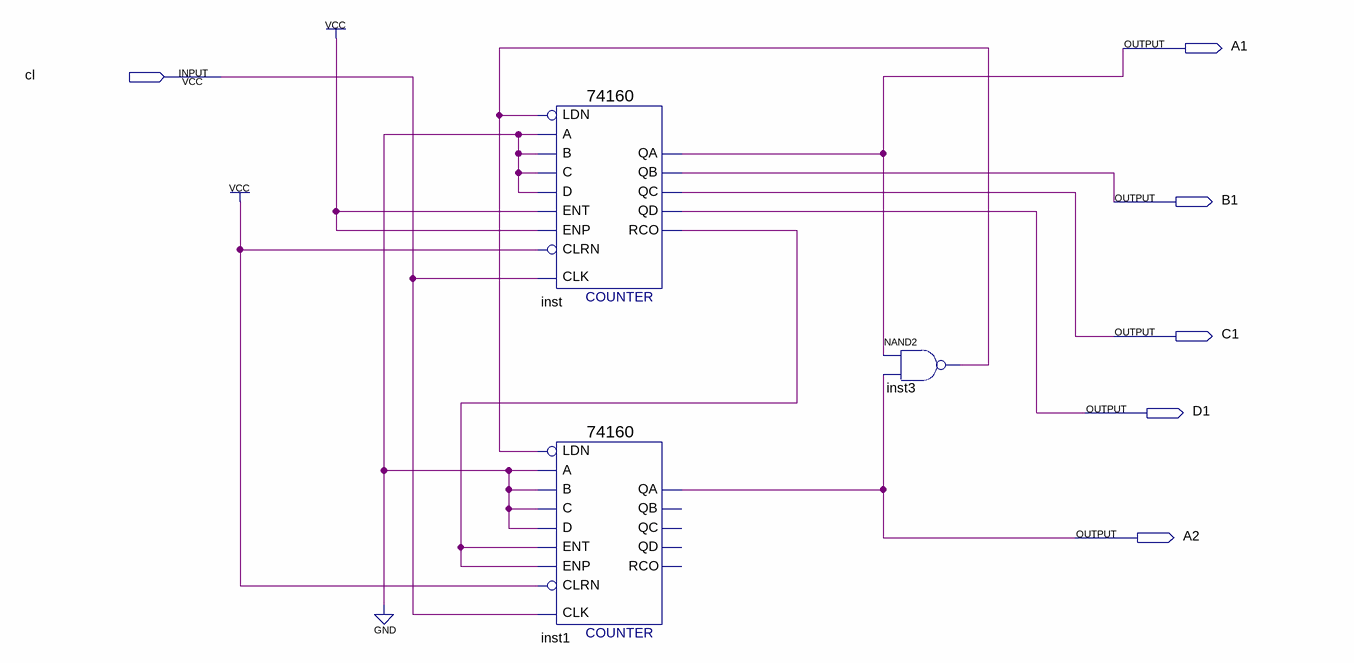
[diagram p0: schematic sheet]
// Quartus schematic EX.bdf as structural Verilog: 3 symbols, 6 pins
module EX (
  input  cl,
  output A1,
  output B1,
  output C1,
  output D1,
  output A2
);

  wire inst3_out, inst_rco;

  \74160  inst (
    .CLK(cl), .ENT(1'b1), .A(1'b0), .B(1'b0), .C(1'b0), .D(1'b0), .LDN(inst3_out), .ENP(1'b1), .CLRN(1'b1),
    .QD(D1), .QA(A1), .QB(B1), .QC(C1), .RCO(inst_rco));
  \74160  inst1 (
    .CLK(cl), .ENT(inst_rco), .A(1'b0), .B(1'b0), .C(1'b0), .D(1'b0), .LDN(inst3_out), .ENP(inst_rco),
    .CLRN(1'b1), .QA(A2));  // open: QD, QB, QC, RCO
  nand inst3 (inst3_out, A1, A2);
endmodule
